# EAGLE design PB1_PSU (EAGLE 7.4.0)
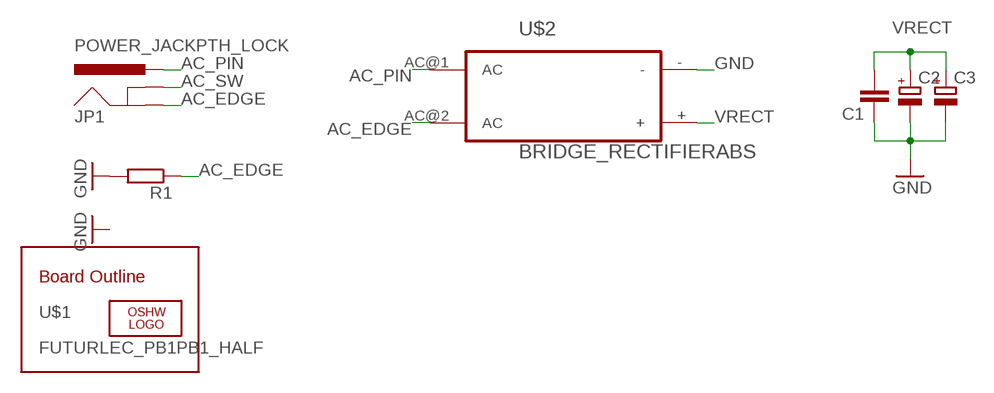
[diagram p0: schematic, sheet 1]

## Parts
C1  C-EUC0805  [C0805]
C2  CPOL-EUE2.5-7  [E2,5-7]
C3  CPOL-EUE5-10.5  [E5-10,5]
JP1  POWER_JACKPTH_LOCK  [POWER_JACK_PTH_LOCK]
LOGO1  OSHW_LOGO_8MILX0200-NT  [OSHW_8X200_NOTEXT]
R1  R-EU_R0805  [R0805]
U$1  FUTURLEC_PB1PB1_HALF  [FUTURLEC_PB1_HALF]
U$2  BRIDGE_RECTIFIERABS  [ABS]

## Nets
AC_EDGE: JP1.GND R1.1 U$2.AC@2(AC)
AC_PIN: JP1.PWR U$2.AC@1(AC)
AC_SW: JP1.GNDBREAK
GND: C1.1 C2.- C3.- R1.2 U$2.-
VRECT: C1.2 C2.+ C3.+ U$2.+

## Library data of the parts
C1 = SquantorRCL:C-EU: CAPACITOR, European symbol
C2 C3 = SquantorRCL:CPOL-EU: POLARIZED CAPACITOR, European symbol
JP1 = SquantorConnectors:POWER_JACK: Power Jack This is the standard 5.5mm barrel jack for power. The PTH is the most common, proven, reliable, footprint. The Slot footprint only works if the mill layer is transmitted to the PCB fab house so be warned. Mating wall wart : TOL-00298 (and others); PROD_ID: CONN-08197; SF_ID: PRT-00119
LOGO1 = ohw-logo:OSHW_LOGO_8MIL
R1 = SquantorRCL:R-EU_: RESISTOR, European symbol
U$1 = SquantorPCBOutline:FUTURLEC_PB1
U$2 = SquantorDiodes:BRIDGE_RECTIFIER

## Board
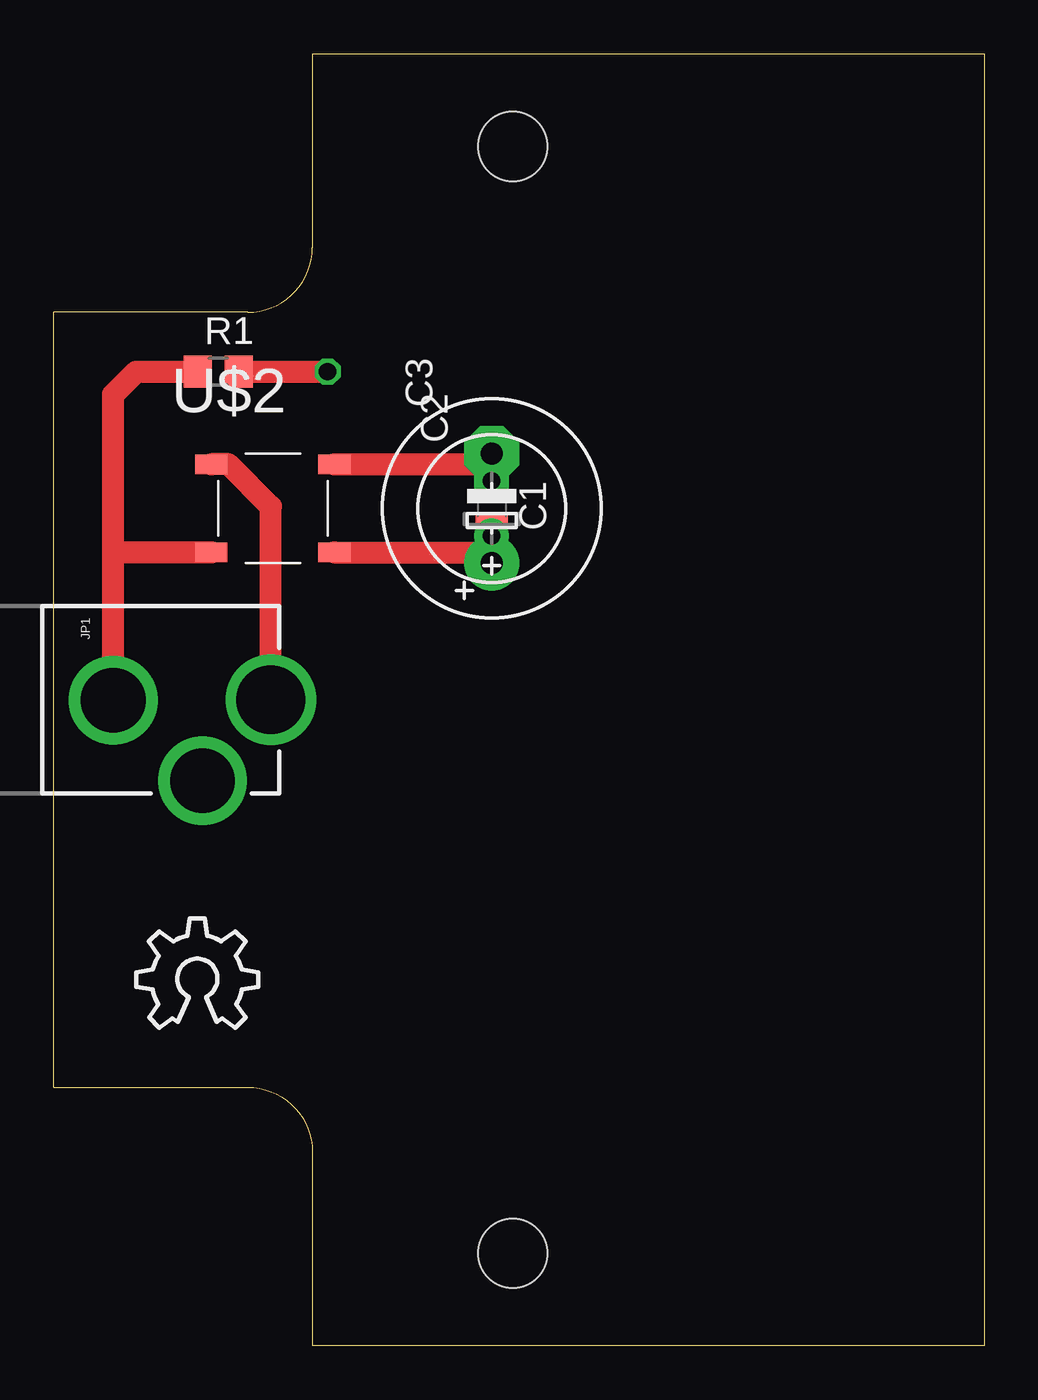
[diagram p1: board, top side]
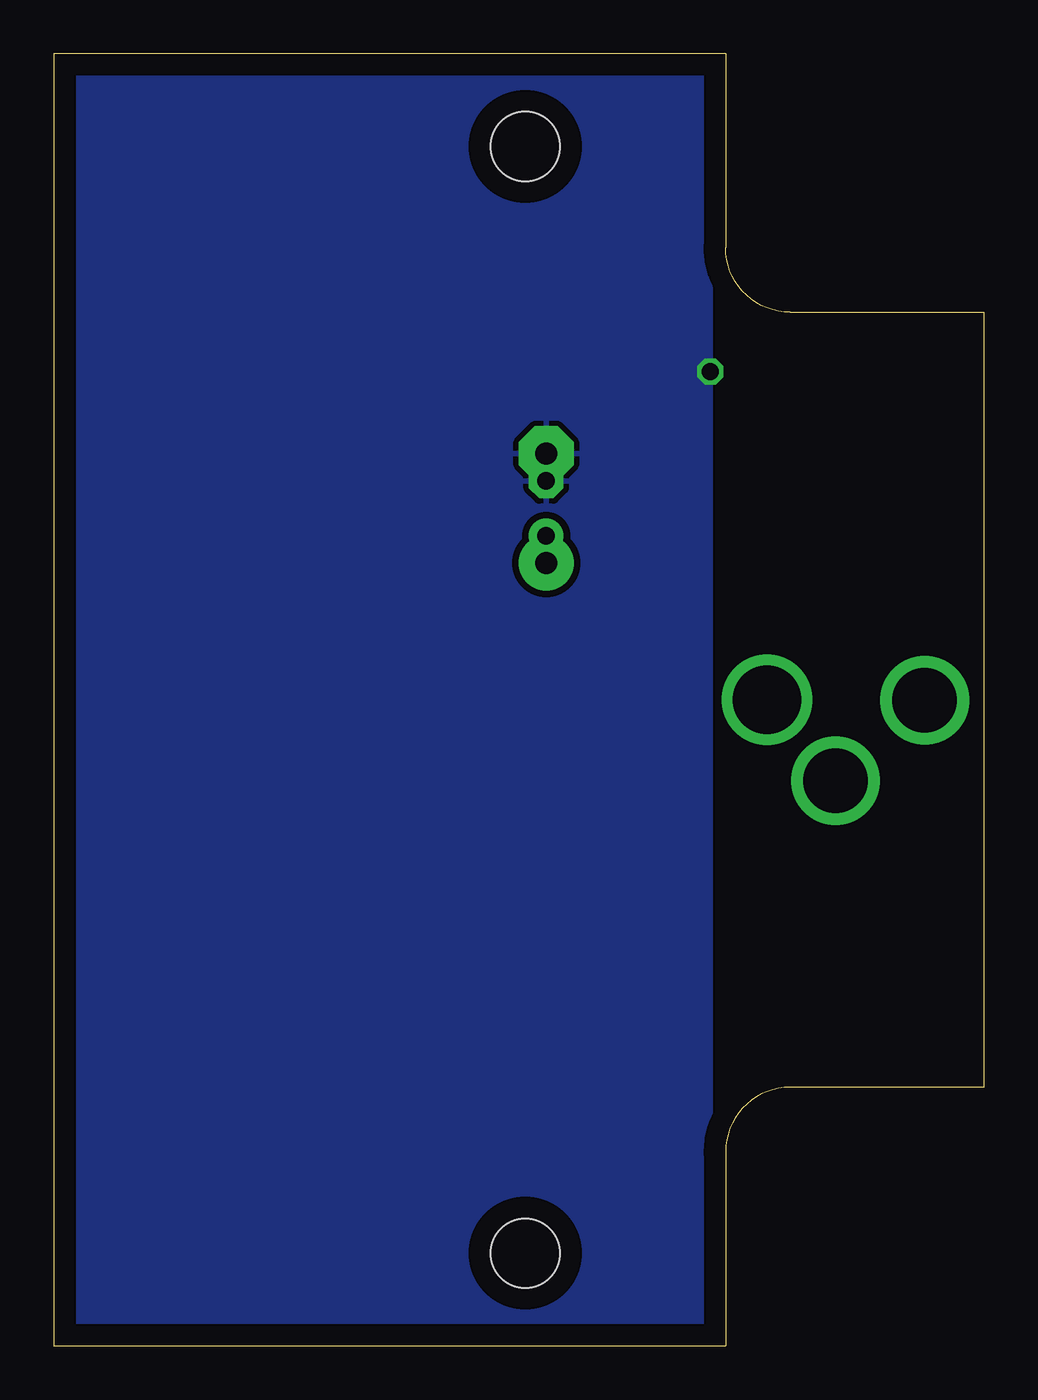
[diagram p2: board, bottom side, seen from below]

Size 43.19 x 60 mm. Coordinates in mm from the lower left corner, seen from the top.
Copper layers (1*16): Top 0.035mm / dielectric 1.5mm / Bottom 0.035mm
Design rules "default": minimum track width 10mil, minimum drill 24mil, track to track 8mil, track to pad 8mil, pad to pad 8mil, via to via 8mil, smd to smd 8mil, copper to edge 40mil, drill to drill 8mil, minimum pad ring 10mil, minimum via ring 8mil, stop-mask expansion 4mil, vias tented up to drill 0mil, thermal gap 10mil

### Footprints (pad centres in the part's own frame; a part is rotated, then mirrored left to right if it is on the bottom)
C0805 = smd 1.3 x 1.5: 1 -0.95,0; 2 0.95,0
E2,5-7 = drill 0.813 pad 1.6: + -1.27,0 | drill 0.813 pad 1.6 octagon: - 1.27,0
E5-10,5 = drill 1.016 pad 2.54: + -2.54,0 | drill 1.016 pad 2.54 octagon: - 2.54,0
POWER_JACK_PTH_LOCK = drill 2.997 pad 4.115: GND 0.025,6.557; GNDBREAK 3.762,10.7 | drill 3.2 pad 4.115: PWR 0,13.878
R0805 = smd 1.3 x 1.5: 1 -0.95,0; 2 0.95,0
FUTURLEC_PB1_HALF = hole 3.2: -5.38,25.7; -5.38,-25.7
ABS = smd 0.9 x 1.5: + 2.05,2.86; - -2.05,2.86; AC@1 -2.05,-2.86; AC@2 2.05,-2.86

### Placement (x,y rotation side)
C1  20.33,38.89 270 top
C2  20.33,38.89 90 top
C3  20.33,38.89 90 top
JP1  -3.8,30 270 top
LOGO1  3.82,14.76 0 top
R1  7.63,45.24 0 top
U$1  26.68,30 0 top
U$2  10.17,38.89 270 top

### Tracks (layer width: path | path; a pad name or v marks a point on that pad's centre or on a via)
AC_EDGE
  Top 1.016: JP1.GND 2.76,36.84 | 2.76,36.84 2.76,44.18 3.82,45.24 R1.1 | U$2.AC@2 2.76,36.84
AC_PIN
  Top 1.016: JP1.PWR 10.08,38.98 8.12,40.94 U$2.AC@1
GND  (via drill 0.8)
  Top 1.016: U$2.- 20.33,40.94 C3.- | C1.1 C2.- | R1.2 v12.71,45.24
  pour Bottom (isolate 0.305): 12.71,50.32 12.71,60.48 43.19,60.48 43.19,-0.48 12.71,-0.48 12.71,9.68
VRECT
  Top 1.016: U$2.+ 20.33,36.84 | 20.33,36.84 C3.+ | C1.2 C2.+ 20.33,36.84